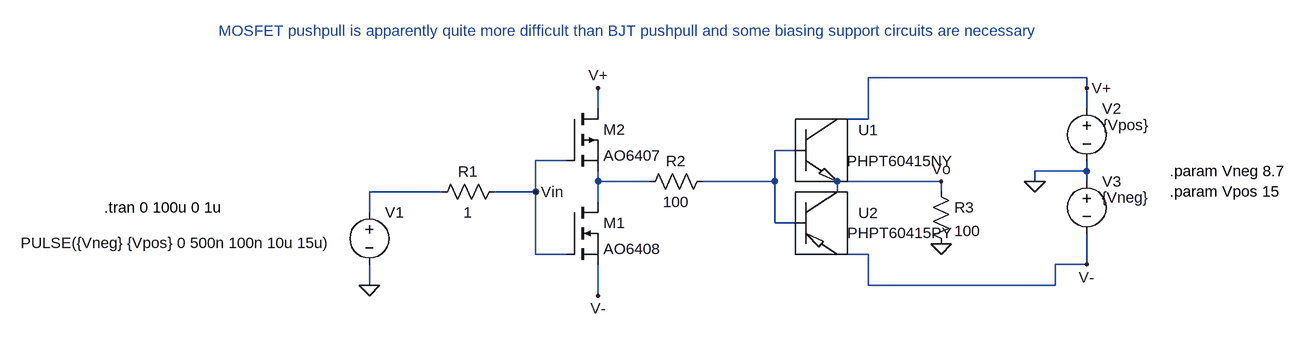
[diagram p0: schematic mosfet-push-pull.asc]
mosfet-push-pull.asc, the LTspice schematic file:
Version 4
SHEET 1 1496 680
WIRE 1184 -96 848 -96
WIRE 1184 -80 1184 -96
WIRE 432 -48 432 -80
WIRE 1184 -48 1184 -80
WIRE 848 -32 848 -96
WIRE 848 -32 800 -32
WIRE 736 16 704 16
WIRE 384 32 336 32
WIRE 1184 48 1184 32
WIRE 1184 48 1104 48
WIRE 432 64 432 48
WIRE 512 64 432 64
WIRE 704 64 704 16
WIRE 704 64 592 64
WIRE 960 64 800 64
WIRE 1104 64 1104 48
WIRE 1184 64 1184 48
WIRE 192 80 80 80
WIRE 336 80 336 32
WIRE 336 80 272 80
WIRE 800 80 800 64
WIRE 960 80 960 64
WIRE 432 96 432 64
WIRE 80 112 80 80
WIRE 704 128 704 64
WIRE 736 128 704 128
WIRE 336 176 336 80
WIRE 384 176 336 176
WIRE 848 176 800 176
WIRE 1184 192 1184 144
WIRE 1184 192 1136 192
WIRE 80 224 80 192
WIRE 848 224 848 176
WIRE 1136 224 1136 192
WIRE 1136 224 848 224
WIRE 432 240 432 192
FLAG 1104 64 0
FLAG 1184 -80 V+
FLAG 1184 192 V-
FLAG 432 240 V-
FLAG 432 -80 V+
FLAG 336 80 Vin
FLAG 960 160 0
FLAG 960 64 Vo
FLAG 80 224 0
SYMBOL voltage 80 96 R0
WINDOW 3 -55 63 Right 2
WINDOW 123 0 0 Left 0
WINDOW 39 0 0 Left 0
SYMATTR Value PULSE({Vneg} {Vpos} 0 500n 100n 10u 15u)
SYMATTR InstName V1
SYMBOL nmos 384 96 R0
SYMATTR InstName M1
SYMATTR Value AO6408
SYMBOL pmos 384 -48 R0
SYMATTR InstName M2
SYMATTR Value AO6407
SYMBOL res 288 64 R90
WINDOW 0 0 56 VBottom 2
WINDOW 3 32 56 VTop 2
SYMATTR InstName R1
SYMATTR Value 1
SYMBOL voltage 1184 -64 R0
WINDOW 3 96 41 Right 2
WINDOW 123 0 0 Left 0
WINDOW 39 0 0 Left 0
SYMATTR Value {Vpos}
SYMATTR InstName V2
SYMBOL voltage 1184 48 R0
WINDOW 3 96 41 Right 2
WINDOW 123 0 0 Left 0
WINDOW 39 0 0 Left 0
SYMATTR Value {Vneg}
SYMATTR InstName V3
SYMBOL res 608 48 R90
WINDOW 0 0 56 VBottom 2
WINDOW 3 32 56 VTop 2
SYMATTR InstName R2
SYMATTR Value 100
SYMBOL res 944 64 R0
SYMATTR InstName R3
SYMATTR Value 100
SYMBOL PHPT60415NY 784 16 R0
SYMATTR InstName U1
SYMBOL PHPT60415PY 784 128 R0
SYMATTR InstName U2
TEXT 1312 48 Left 2 !.param Vneg 8.7\n.param Vpos 15
TEXT -328 104 Left 2 !.tran 0 100u 0 1u
TEXT -152 -168 Left 2 ;MOSFET pushpull is apparently quite more difficult than BJT pushpull and some biasing support circuits are necessary

The netlist it stands for:
* mosfet-push-pull.asc
V1 N003 0 PULSE({Vneg} {Vpos} 0 500n 100n 10u 15u)
M1 N002 Vin V- V- AO6408
M2 V+ Vin N002 N002 AO6407
R1 Vin N003 1
V2 V+ 0 {Vpos}
V3 0 V- {Vneg}
R2 N001 N002 100
R3 Vo 0 100
XU1 V+ N001 Vo PHPT60415NY  ; pins 1 2 3
XU2 Vo N001 V- PHPT60415PY  ; pins 1 2 3
.model NMOS NMOS
.model PMOS PMOS
.lib standard.mos
.param Vneg 8.7
.param Vpos 15
.tran 0 100u 0 1u
* MOSFET pushpull is apparently quite more difficult than BJT pushpull and some biasing support circuits are necessary
.lib PHPT60415NY.lib
.lib PHPT60415PY.lib
.backanno
.end